# Altium schematic sheet AD9833_Diff_Output_Current_Source.SchDoc
size A3
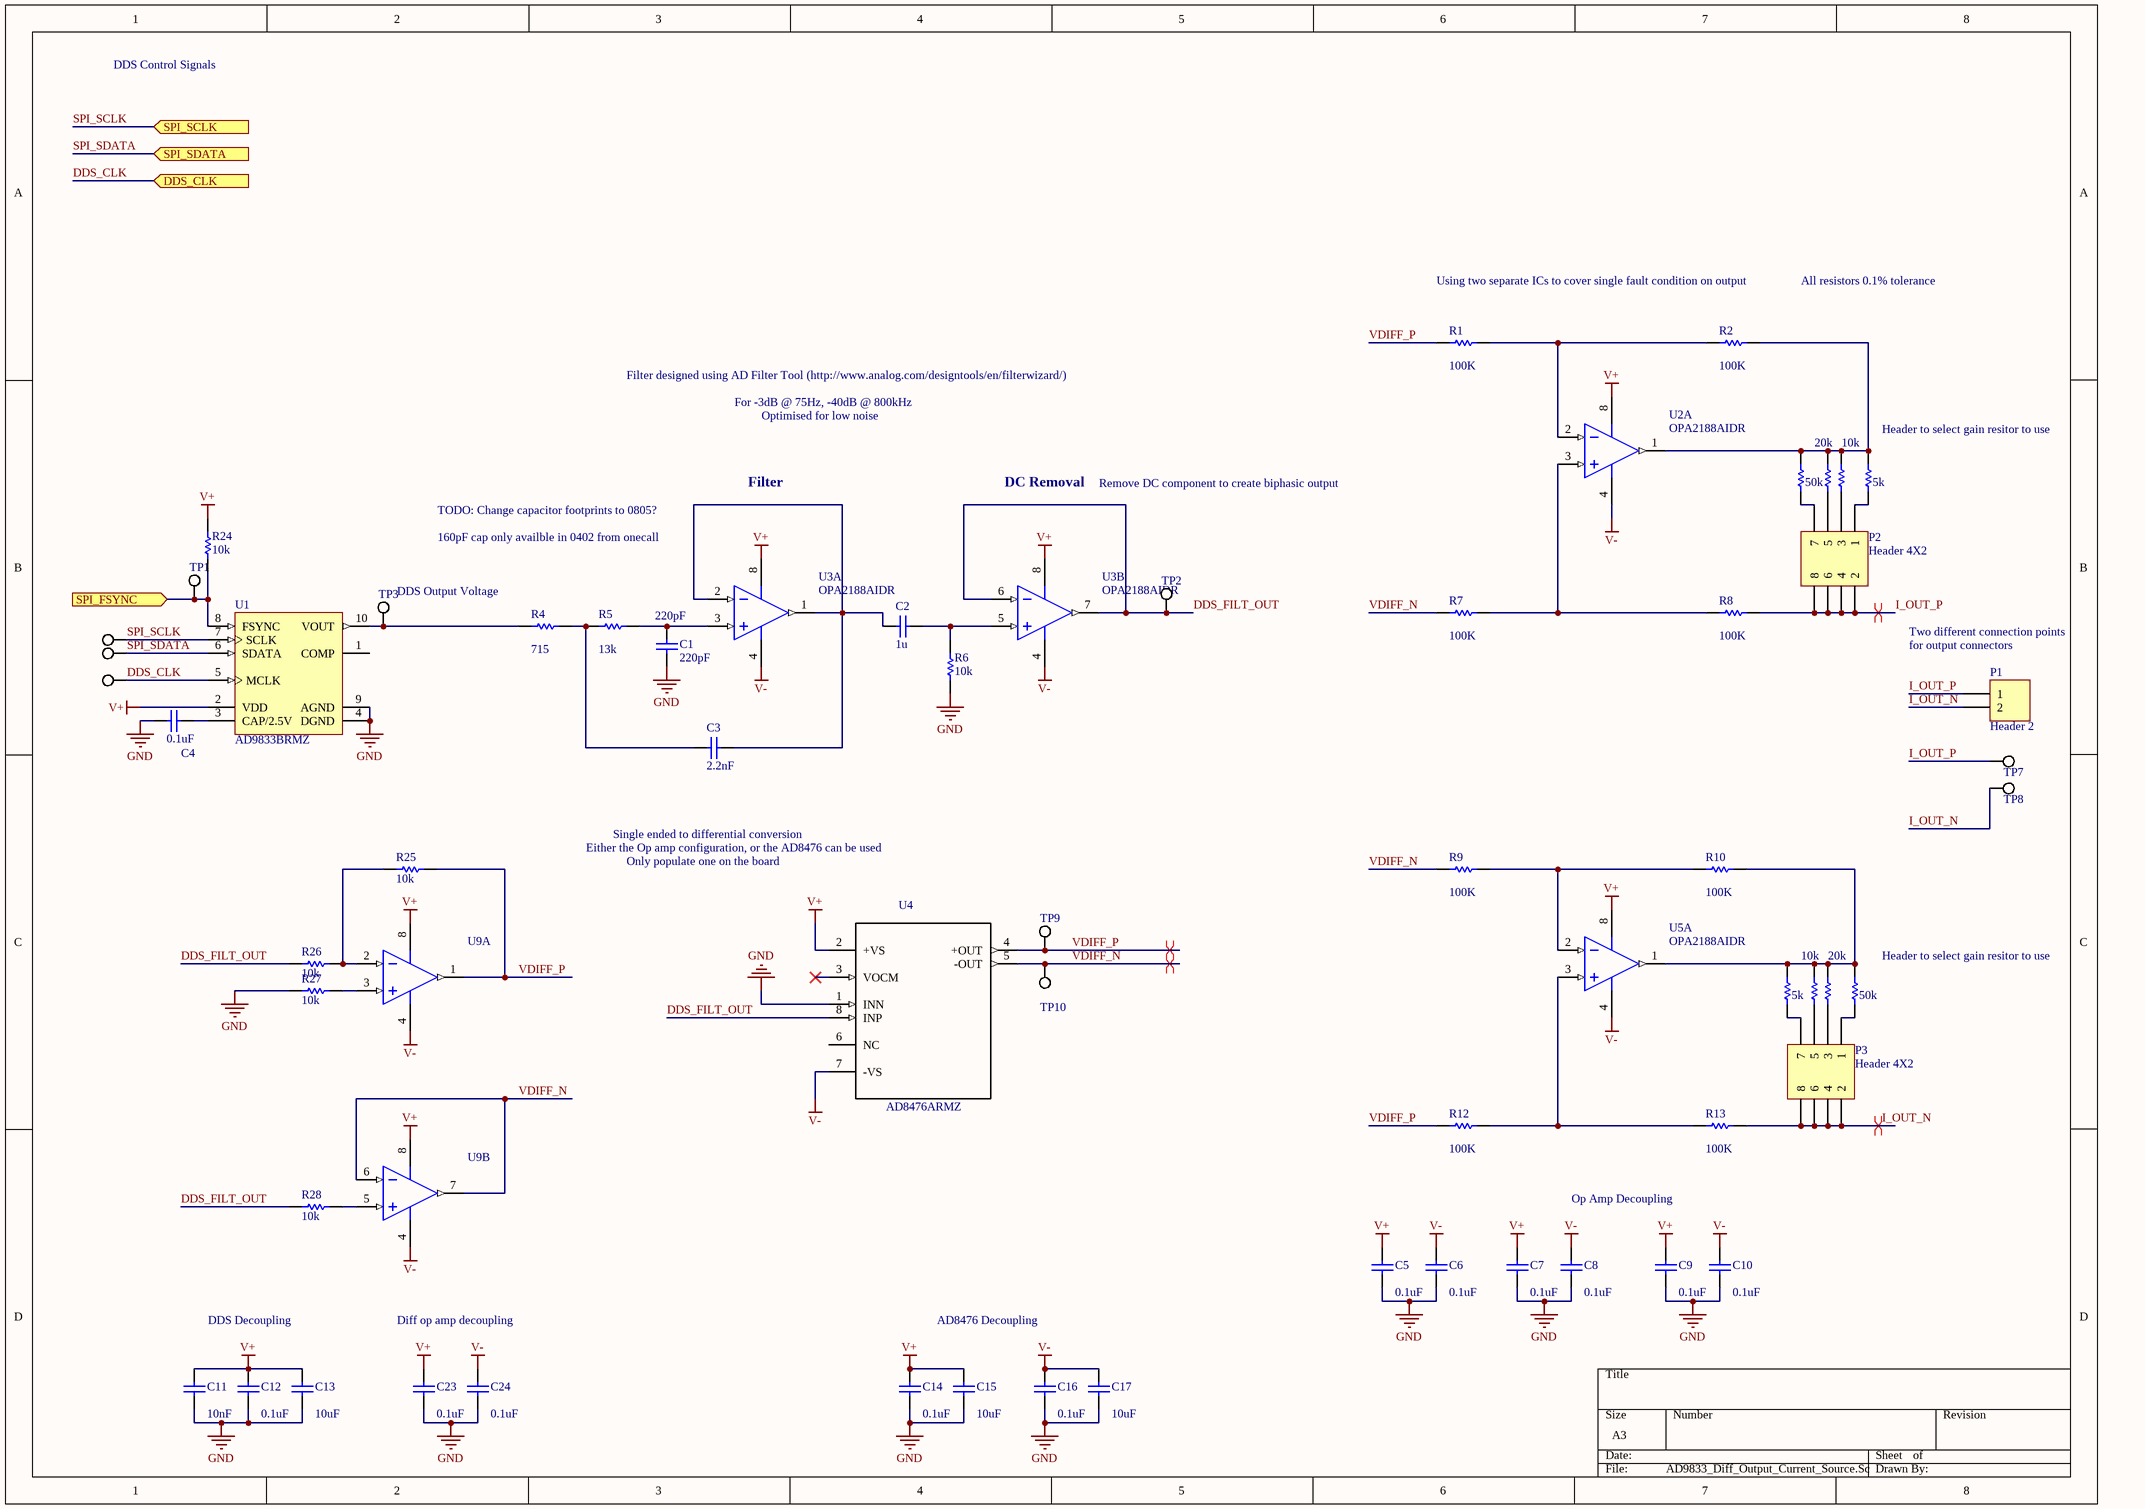
[diagram p0: AD9833_Diff_Output_Current_Source.SchDoc]

## Parts
C1  220pF  [1608[0603]]
C2  1u  [1608[0603]]
C3  2.2nF  [1608[0603]]
C4  0.1uF  [1608[0603]]
C5  0.1uF  [1608[0603]]
C6  0.1uF  [1608[0603]]
C7  0.1uF  [1608[0603]]
C8  0.1uF  [1608[0603]]
C9  0.1uF  [1608[0603]]
C10  0.1uF  [1608[0603]]
C11  10nF  [1608[0603]]
C12  0.1uF  [1608[0603]]
C13  10uF  [1608[0603]]
C14  0.1uF  [1608[0603]]
C15  10uF  [1608[0603]]
C16  0.1uF  [1608[0603]]
C17  10uF  [1608[0603]]
C23  0.1uF  [1608[0603]]
C24  0.1uF  [1608[0603]]
P1  Header 2  [HDR1X2]
P2  Header 4X2  [HDR2X4]
P3  Header 4X2  [HDR2X4]
R1  100K  [6-0805_M]
R2  100K  [6-0805_M]
R3  50k  [6-0805_M]
R4  715  [6-0805_M]
R5  13k  [6-0805_M]
R6  10k  [6-0805_M]
R7  100K  [6-0805_M]
R8  100K  [6-0805_M]
R9  100K  [6-0805_M]
R10  100K  [6-0805_M]
R11  20k  [6-0805_M]
R12  100K  [6-0805_M]
R13  100K  [6-0805_M]
R18  10k  [6-0805_M]
R19  5k  [6-0805_M]
R20  5k  [6-0805_M]
R21  10k  [6-0805_M]
R22  20k  [6-0805_M]
R23  50k  [6-0805_M]
R24  10k  [6-0805_M]
R25  10k  [6-0805_M]
R26  10k  [6-0805_M]
R27  10k  [6-0805_M]
R28  10k  [6-0805_M]
TP1  TESTPOINT_WHITE  [TestPointVia]  (value not drawn)
TP2  TESTPOINT_WHITE  [TestPointVia]  (value not drawn)
TP3  TESTPOINT_WHITE  [TestPointVia]  (value not drawn)
TP4  TESTPOINT_WHITE  [TestPointVia]  (value not drawn)
TP5  TESTPOINT_WHITE  [TestPointVia]  (value not drawn)
TP6  TESTPOINT_WHITE  [TestPointVia]  (value not drawn)
TP7  TESTPOINT_WHITE  [TestPointVia]  (value not drawn)
TP8  TESTPOINT_WHITE  [TestPointVia]  (value not drawn)
TP9  TESTPOINT_WHITE  [TestPointVia]  (value not drawn)
TP10  TESTPOINT_WHITE  [TestPointVia]  (value not drawn)
U1  AD9833BRMZ  [ADI-RM-10_M]
U2  OPA2188AIDR  [D0008A_L]  (part A of 2)
U3  OPA2188AIDR  [D0008A_L]  (parts A,B of 2)
U4  AD8476ARMZ  [SOP65P490X110-8N]
U5  OPA2188AIDR  [D0008A_L]  (part A of 2)
U9  OPA2188AIDR  [D0008A_L]  (value not drawn)  (parts A,B of 2)

## Ports
DDS_CLK (in), SPI_FSYNC (in), SPI_SCLK (in), SPI_SDATA (in)

## Nets
GND: C1.1 C4.1 C5.1 C6.1 C7.1 C8.1 C9.1 C10.1 C11.1 C12.1 C13.1 C14.1 C15.1 C16.1 C17.1 C23.1 C24.1 R6.1 R27.2 U1.4(DGND) U1.9(AGND) U4.1(INN)
V+: C5.2 C7.2 C9.2 C11.2 C12.2 C13.2 C14.2 C15.2 C23.2 R24.2 U1.2(VDD) U2.8(V+) U3.8(V+) U4.2(+VS) U5.8(V+) U9.8(V+)
V-: C6.2 C8.2 C10.2 C16.2 C17.2 C24.2 U2.4(V-) U3.4(V-) U4.7(-VS) U5.4(V-) U9.4(V-)
DDS_CLK: TP6.1 U1.5(MCLK) ; port DDS_CLK
DDS_FILT_OUT: R26.2 R28.2 TP2.1 U3.6(IN_B-) U3.7(OUT_B) U4.8(INP)
I_OUT_N: P1.2 P3.2 P3.4 P3.6 P3.8 R13.2 TP8.1
I_OUT_P: P1.1 P2.2 P2.4 P2.6 P2.8 R8.2 TP7.1
SPI_FSYNC: R24.1 TP1.1 U1.8(FSYNC) ; port SPI_FSYNC
SPI_SCLK: TP4.1 U1.7(SCLK) ; port SPI_SCLK
SPI_SDATA: TP5.1 U1.6(SDATA) ; port SPI_SDATA
VDIFF_N: R7.1 R9.1 TP10.1 U4.5(-OUT) U9.6(IN_B-) U9.7(OUT_B)
VDIFF_P: R1.1 R12.1 R25.1 TP9.1 U4.4(+OUT) U9.1(OUT_A)
NetC1_2: C1.2 R5.2 U3.3(IN_A+)
NetC2_1: C2.1 C3.1 U3.1(OUT_A) U3.2(IN_A-)
NetC2_2: C2.2 R6.2 U3.5(IN_B+)
NetC3_2: C3.2 R4.2 R5.1
NetC4_2: C4.2 U1.3(CAP/2.5V)
NetP2_1: P2.1 R19.2
NetP2_3: P2.3 R18.2
NetP2_5: P2.5 R11.2
NetP2_7: P2.7 R3.1
NetP3_1: P3.1 R23.1
NetP3_3: P3.3 R22.2
NetP3_5: P3.5 R21.2
NetP3_7: P3.7 R20.2
NetR1_2: R1.2 R2.1 U2.2(IN_A-)
NetR2_2: R2.2 R3.2 R11.1 R18.1 R19.1 U2.1(OUT_A)
NetR4_1: R4.1 TP3.1 U1.10(VOUT)
NetR7_2: R7.2 R8.1 U2.3(IN_A+)
NetR9_2: R9.2 R10.1 U5.2(IN_A-)
NetR10_2: R10.2 R20.1 R21.1 R22.1 R23.2 U5.1(OUT_A)
NetR12_2: R12.2 R13.1 U5.3(IN_A+)
NetR25_2: R25.2 R26.1 U9.2(IN_A-)
NetR27_1: R27.1 U9.3(IN_A+)
NetR28_1: R28.1 U9.5(IN_B+)

Not connected (* = marked no-connect by the designer): U1 1(COMP); U4 3(VOCM)* 6(NC)

## Layout directives
differential pair: I_OUT_N, I_OUT_P, VDIFF_N, VDIFF_P

## Notes on the sheet
- DDS Control Signals
- Using two separate ICs to cover single fault condition on output
- All resistors 0.1% tolerance
- Filter designed using AD Filter Tool (http://www.analog.com/designtools/en/filterwizard/)
- For -3dB @ 75Hz, -40dB @ 800kHz
- Optimised for low noise
- Header to select gain resitor to use
- TODO: Change capacitor footprints to 0805?
- Filter
- DC Removal
- Remove DC component to create biphasic output
- (near U3) 160pF cap only availble in 0402 from onecall
- (near TP3) DDS Output Voltage
- Two different connection points
- (near P1) for output connectors
- Either the Op amp configuration, or the AD8476 can be used
- Single ended to differential conversion
- Only populate one on the board
- (near R23) Header to select gain resitor to use
- Op Amp Decoupling
- DDS Decoupling
- Diff op amp decoupling
- AD8476 Decoupling

## Library data of the parts
C1-C17 C23 C24 = Cap Semi: Capacitor (Semiconductor SIM Model); Published: 8-Jun-2000; LatestRevisionDate: 29-May-2009; LatestRevisionNote: IPC-7351 Footprint Added.; PackageReference: C1206; Publisher: Altium Limited; PackageDescription: Chip Capacitor
  C1: Value: 220pF
  C2: Value: 1u
  C3: Value: 2.2nF
  C4-C10 C12 C14 C16 C23 C24: Value: 0.1uF
  C11: Value: 10nF
  C13 C15 C17: Value: 10uF
P1 = Header 2: Header, 2-Pin; LatestRevisionDate: 17-Jul-2002; LatestRevisionNote: Re-released for DXP Platform.; Publisher: Altium Limited
P2 P3 = Header 4X2: Header, 4-Pin, Dual row; LatestRevisionDate: 17-Jul-2002; LatestRevisionNote: Re-released for DXP Platform.; Publisher: Altium Limited
R1-R13 R18-R28 = Res1: Resistor; Published: 8-Jun-2000; LatestRevisionDate: 17-Jul-2002; LatestRevisionNote: Re-released for DXP Platform.; PackageReference: AXIAL-0.3; Publisher: Altium Limited; PackageDescription: Axial Device, Thru-Hole; 2 Leads; 0.3 in Pin Spacing
  R1 R2 R7-R10 R12 R13: Value: 100K
  R3 R23: Value: 50k
  R4: Value: 715
  R5: Value: 13k
  R6 R18 R21 R24-R28: Value: 10k
  R11 R22: Value: 20k
  R19 R20: Value: 5k
U1 = CMP-0293-00077-1: Low Power, 12.65 mW, 2.3 V to 5.5 V, Programmable Waveform Generator, 10-Bit, Serial, RM-10, 50 Tube, Pb-Free; Resolution (Bits): 10bit; Compliance Range (V): 650mV; FS Iout (mA nom): 3mA; REFCLK Multiplier: No; Master fclk: 25MHz; I Supply total (max): 5.5mA; Tuning Word Width (bits): 28bit; Code_JEDEC: MO-187-BA; DatasheetVersion: Rev. D; PackageVersion: 5/8/2005; ComponentLink1URL: www.analog.com; ComponentLink3Description: Package Specification; PackageDescription: 10-Lead Mini Small Outline Package [MSOP]; I/O Interface: Serial; ComponentLink2Description: Datasheet; ComponentLink1Description: Manufacturer URL; PackageReference: RM-10; ComponentLink2URL: http://www.analog.com/static/imported-files/data_sheets/AD9833.pdf; ComponentLink3URL: http://www.analog.com/static/imported-files/packages/PKG_PDF/MSOP%28RM%29/RM_10.pdf
U2 U3 U5 U9 = CMP-0272-00241-3: 0.03 uV/degC, 6 uV Vos, Low Noise, Rail-to-Rail Output, Zero-Drift Operational Amplifier, 4 to 36 V, -40 to 105 degC, 8-pin SOIC (D8), Green (RoHS & no Sb/Br); Manufacturer: Texas Instruments; Rating: Catalog; Number of Channels: 2; CMRR(Min)(dB): 120; Total Supply Voltage(Max)(+5V is 5, +/-5V is 10): 36; Packing: LARGE T&R; Slew Rate(Typ)(V/us): 0.8; Iq per channel(Max)(mA): 0.475; Vio (25C)(Max)(mV): 0.025; IIB(Max)(pA): 850; Offset Drift(Typ)(uV/C): 0.03; Sub Family: High Supply Voltage Amplifier (>=30V), Low Noise Amp (<=10nV/rtHz), Low Offset Voltage Amplifier (<=500uV), Low Power Amp (<=500uA), Precision Amplifier, Zero Drift Precision Amplifier; Total Supply Voltage(Min)(+5V is 5, +/-5V is 10): 4; Mounting Technology: Surface Mount; Code_JEDEC: MS-012; ComponentLink2Description: Datasheet; DatasheetVersion: SBOS525B; ComponentLink1URL: http://www.ti.com/; GBW(Typ)(MHz): 2; Eco-Plan: Green (RoHS & no Sb/Br); PackageVersion: 4040047-3/M, 06/2011; ComponentLink3Description: Package Specification; ComponentLink1Description: Manufacturer URL; PartNumber: OPA2188AIDR; ComponentLink2URL: http://www.ti.com/lit/ds/symlink/opa2188.pdf; ComponentLink3URL: http://www.ti.com/litv/pdf/msoi002j; PackageReference: D0008A; PackageDescription: 8-Pin Plastic Small Outline, Body 4.9 x 3.9 mm, Pitch 1.27 mm; PartId: 1
U4 = AD8476ARMZ: SP Amp DIFF AMP Single R-R O/P Â±9V/18V 8-Pin MSOP Tube; MF: Analog Devices; Price: 4.14 USD; Package: MSOP-8 Analog Devices; MP: AD8476ARMZ; Availability: Good; Value: *